# Altium project controle_motor_official.PrjPcb
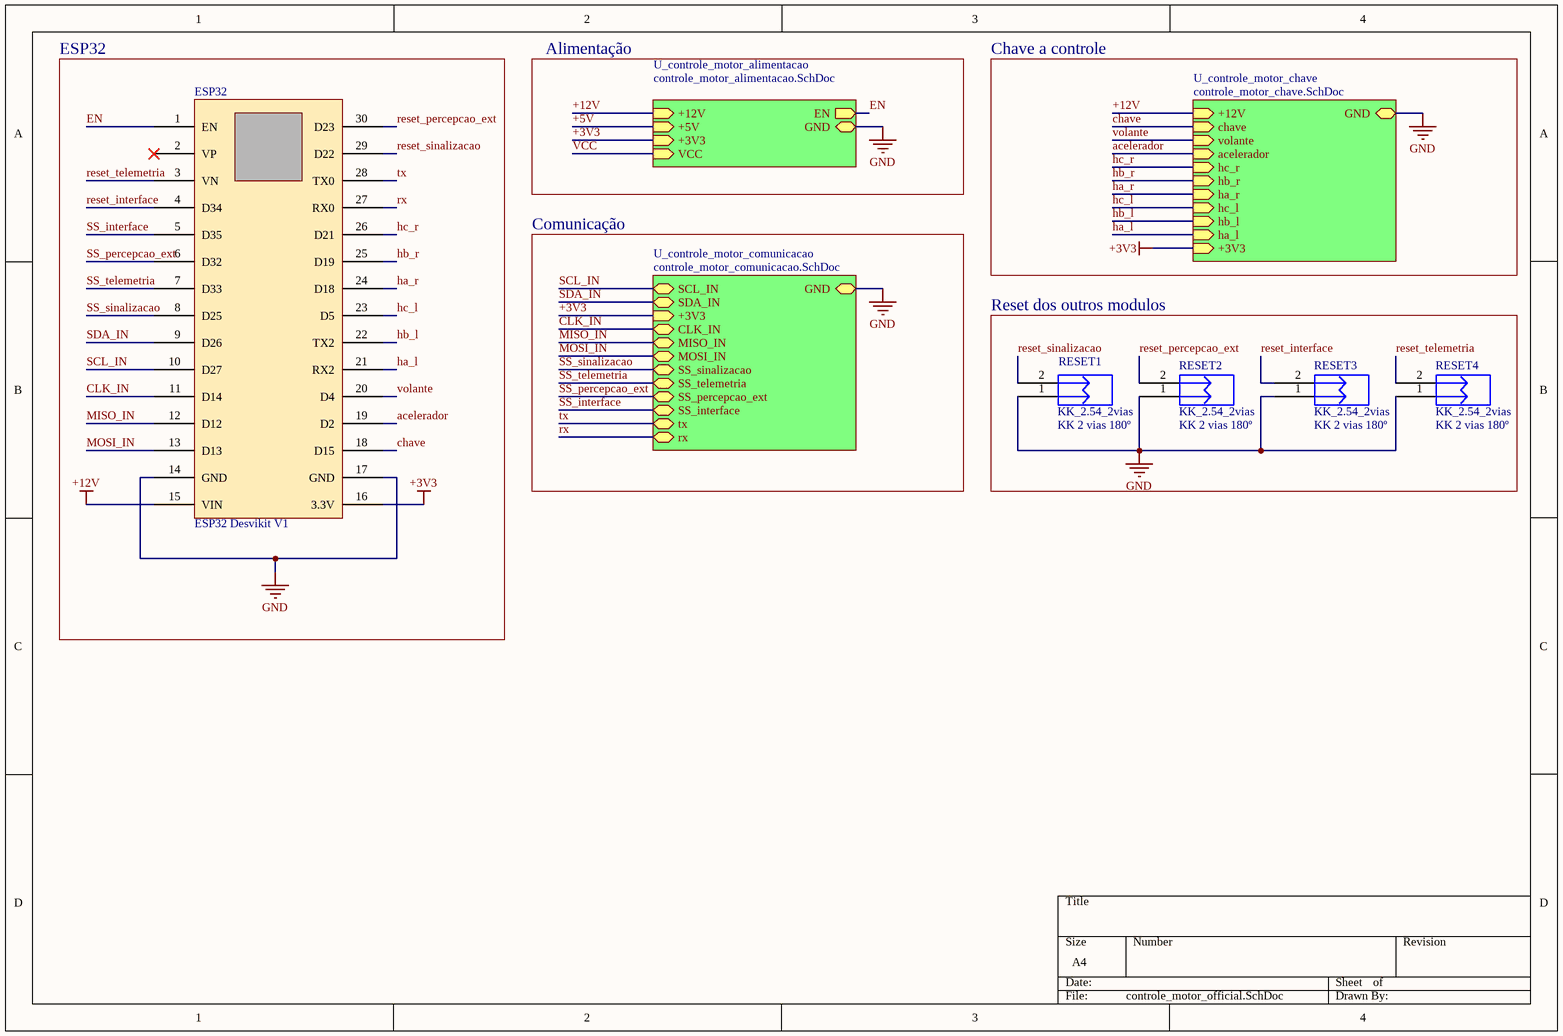
[diagram p0: controle_motor_official.SchDoc]
4 sheets, 45 parts. Net scope: hierarchical (ports join the sheet entries above them; power ports are global).
Board file: controle_motor_official.PcbDoc
Sheets:
  controle_motor_official.SchDoc
    U_controle_motor_alimentacao = controle_motor_alimentacao.SchDoc
    U_controle_motor_chave = controle_motor_chave.SchDoc
    U_controle_motor_comunicacao = controle_motor_comunicacao.SchDoc

## Sheet controle_motor_official.SchDoc
size A4; SheetNumber: 1; SheetTotal: 4

### Parts
ESP32  value ESP32 Desvikit V1  [ESP32_Desvikit_v1]  (hidden comment: microcontrolador)
RESET1  KK_2.54_2vias  Valor: KK 2 vias 180º  [KK_2VIAS_180º]
RESET2  KK_2.54_2vias  Valor: KK 2 vias 180º  [KK_2VIAS_180º]
RESET3  KK_2.54_2vias  Valor: KK 2 vias 180º  [KK_2VIAS_180º]
RESET4  KK_2.54_2vias  Valor: KK 2 vias 180º  [KK_2VIAS_180º]

### Blocks framed on the sheet
ESP32: ESP32
Reset dos outros modulos: RESET1-RESET4

### Sub-sheets
U_controle_motor_alimentacao = controle_motor_alimentacao.SchDoc: EN (out), GND (bidir), +12V (in), +5V (in), +3V3 (in), VCC (in)
U_controle_motor_chave = controle_motor_chave.SchDoc: GND (bidir), +12V (in), chave (in), volante (in), acelerador (in), hc_r (in), hb_r (in), ha_r (in), hc_l (in), hb_l (in), ha_l (in), +3V3 (in)
U_controle_motor_comunicacao = controle_motor_comunicacao.SchDoc: SCL_IN (bidir), SDA_IN (bidir), GND (bidir), +3V3 (in), CLK_IN (bidir), MISO_IN (bidir), MOSI_IN (bidir), SS_sinalizacao (bidir), SS_telemetria (bidir), SS_percepcao_ext (bidir), SS_interface (bidir), tx (bidir), rx (bidir)

### Nets
+3V3: ESP32.16(3.3V) ; sheet U_controle_motor_alimentacao/+3V3, sheet U_controle_motor_chave/+3V3, sheet U_controle_motor_comunicacao/+3V3
+12V: ESP32.15(VIN) ; sheet U_controle_motor_alimentacao/+12V, sheet U_controle_motor_chave/+12V
GND: ESP32.14(GND) ESP32.17(GND) RESET1.1 RESET2.1 RESET3.1 RESET4.1 ; sheet U_controle_motor_alimentacao/GND, sheet U_controle_motor_chave/GND, sheet U_controle_motor_comunicacao/GND
acelerador: ESP32.19(D2) ; sheet U_controle_motor_chave/acelerador
chave: ESP32.18(D15) ; sheet U_controle_motor_chave/chave
CLK_IN: ESP32.11(D14) ; sheet U_controle_motor_comunicacao/CLK_IN
EN: ESP32.1(EN) ; sheet U_controle_motor_alimentacao/EN
ha_l: ESP32.21(RX2) ; sheet U_controle_motor_chave/ha_l
ha_r: ESP32.24(D18) ; sheet U_controle_motor_chave/ha_r
hb_l: ESP32.22(TX2) ; sheet U_controle_motor_chave/hb_l
hb_r: ESP32.25(D19) ; sheet U_controle_motor_chave/hb_r
hc_l: ESP32.23(D5) ; sheet U_controle_motor_chave/hc_l
hc_r: ESP32.26(D21) ; sheet U_controle_motor_chave/hc_r
MISO_IN: ESP32.12(D12) ; sheet U_controle_motor_comunicacao/MISO_IN
MOSI_IN: ESP32.13(D13) ; sheet U_controle_motor_comunicacao/MOSI_IN
reset_interface: ESP32.4(D34) RESET3.2
reset_percepcao_ext: ESP32.30(D23) RESET2.2
reset_sinalizacao: ESP32.29(D22) RESET1.2
reset_telemetria: ESP32.3(VN) RESET4.2
rx: ESP32.27(RX0) ; sheet U_controle_motor_comunicacao/rx
SCL_IN: ESP32.10(D27) ; sheet U_controle_motor_comunicacao/SCL_IN
SDA_IN: ESP32.9(D26) ; sheet U_controle_motor_comunicacao/SDA_IN
SS_interface: ESP32.5(D35) ; sheet U_controle_motor_comunicacao/SS_interface
SS_percepcao_ext: ESP32.6(D32) ; sheet U_controle_motor_comunicacao/SS_percepcao_ext
SS_sinalizacao: ESP32.8(D25) ; sheet U_controle_motor_comunicacao/SS_sinalizacao
SS_telemetria: ESP32.7(D33) ; sheet U_controle_motor_comunicacao/SS_telemetria
tx: ESP32.28(TX0) ; sheet U_controle_motor_comunicacao/tx
VCC: sheet U_controle_motor_alimentacao/VCC
volante: ESP32.20(D4) ; sheet U_controle_motor_chave/volante

Not connected (* = marked no-connect by the designer): ESP32 2(VP)*

### Notes on the sheet
- Alimentação
- Chave a controle
- Comunicação

### Library data of the parts
ESP32 = ESP32 Desvikit v1: microcontrolador com moculo bluethoth e wifi
RESET1-RESET4 = KK_2.54_2vias: Conector KK 2.54mm 2 vias; Descrição: Conector KK 3 vias com passo 2.54mm; Encapsulamento: PTH - 180º; Modelo: 2 vias - 180º; Marca: *; Observação: *

## Sheet controle_motor_alimentacao.SchDoc
size A4; SheetNumber: 3; SheetTotal: 4
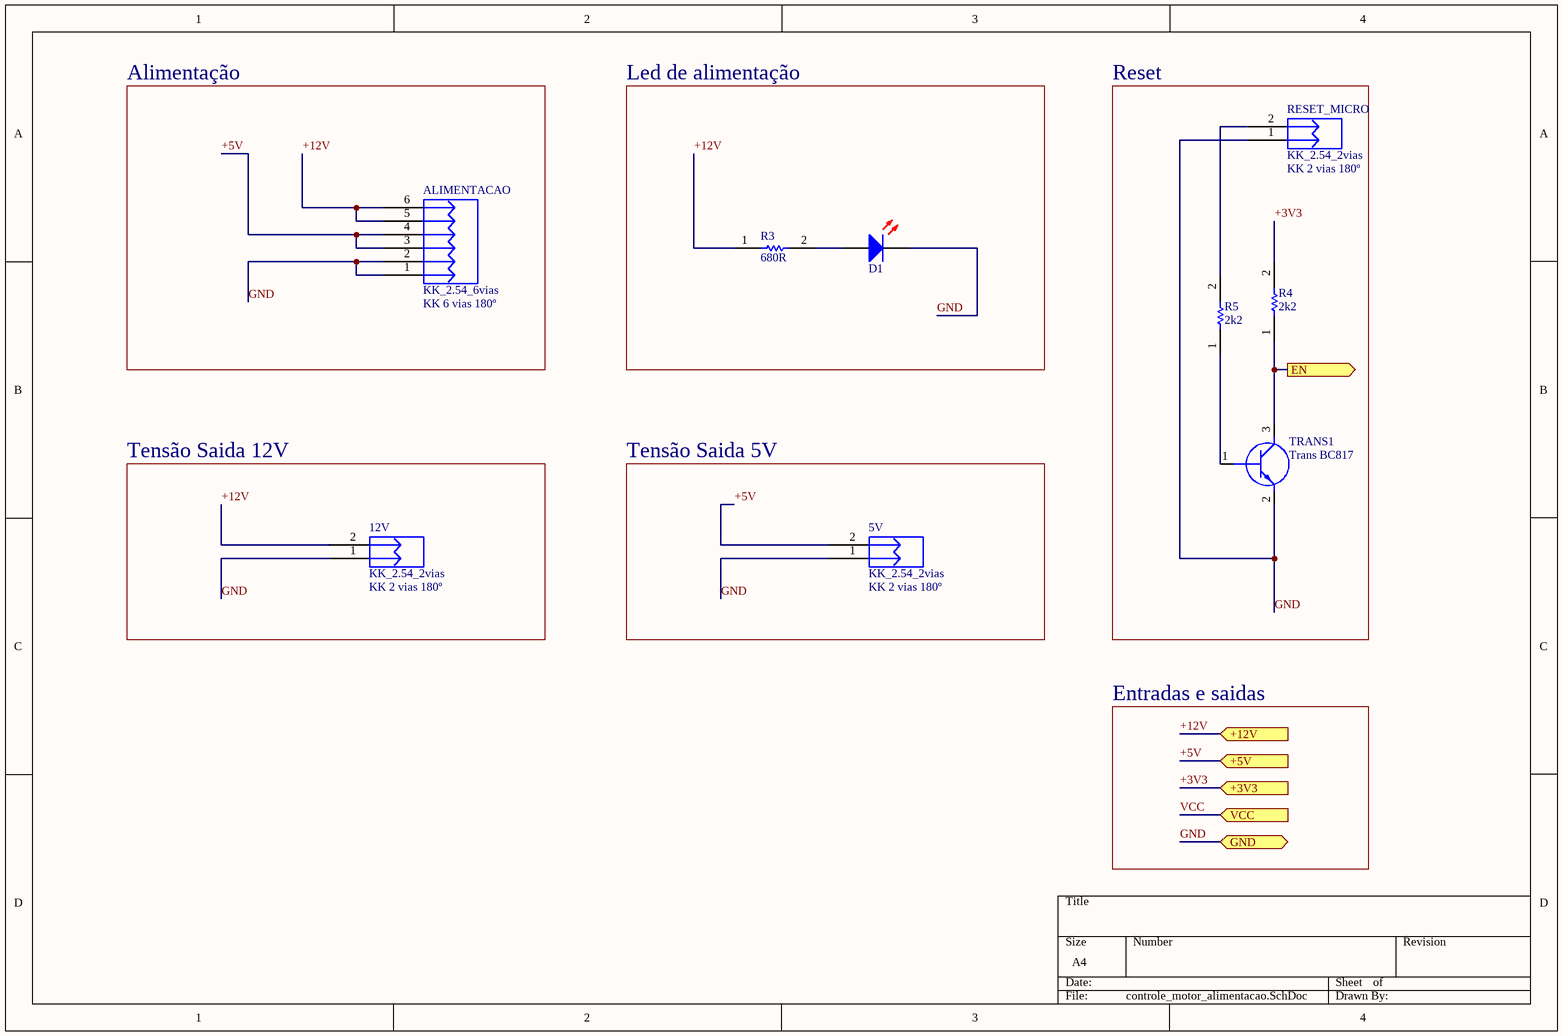
[diagram p1: controle_motor_alimentacao.SchDoc]

### Parts
5V  KK_2.54_2vias  Valor: KK 2 vias 180º  [KK_2VIAS_180º]
12V  KK_2.54_2vias  Valor: KK 2 vias 180º  [KK_2VIAS_180º]
ALIMENTACAO  KK_2.54_6vias  Valor: KK 6 vias 180º  [KK_6vias_180°]
D1  LED 3MM RED  [LED RED]  (value not drawn)
R3  680R  [RESC3216X60N]
R4  2k2  [RESC3216X60N]
R5  2k2  [RESC3216X60N]
RESET_MICRO  KK_2.54_2vias  Valor: KK 2 vias 180º  [KK_2VIAS_180º]
TRANS1  Trans BC817  [SOT96P240X110-3N]

### Blocks framed on the sheet
Alimentação: ALIMENTACAO
Led de alimentação: D1 R3
Reset: R4 R5 RESET_MICRO TRANS1
Tensão Saida 12V: 12V
Tensão Saida 5V: 5V

### Ports
+3V3 (in), +5V (in), +12V (in), EN (out), GND (bidir), VCC (in)

### Nets
+3V3: R4.2 ; port +3V3
+12V: 12V.2 ALIMENTACAO.5 ALIMENTACAO.6 R3.1 ; port +12V
GND: 5V.1 12V.1 ALIMENTACAO.1 ALIMENTACAO.2 D1.2(K) RESET_MICRO.1 TRANS1.2(E) ; port GND
+5V: 5V.2 ALIMENTACAO.3 ALIMENTACAO.4 ; port +5V
EN: R4.1 TRANS1.3(C) ; port EN
VCC: port VCC
NetD1_1: D1.1(A) R3.2
NetR5_1: R5.1 TRANS1.1(B)
NetR5_2: R5.2 RESET_MICRO.2

### Notes on the sheet
- Entradas e saidas

### Library data of the parts
5V 12V RESET_MICRO = KK_2.54_2vias: as RESET1 on sheet controle_motor_official; Marca: *; Observação: *
ALIMENTACAO = KK_2.54_6vias: Conector KK 2.54mm 6 vias; Descrição: Conector KK 3 vias com passo 2.54mm; Encapsulamento: PTH - 180º; Modelo: 3 vias - 180º; Marca: *; Observação: *
D1 = LED 3MM RED: Manufacturer: Paralight; Manufacturer Part Number: IMP585; Wavelength Typ: 625; Forward Voltage: 2; Forward Current If: 20; Luminous Intensity: 3; LED Mounting: Through Hole; Lens Shape: Round; Viewing Angle: 60°; SVHC: No SVHC (15-Jun-2015); External Diameter: 2.9; External Length / Height: 4.6; Forward Voltage VF Max: 2.5; LED / Lamp Size: 3mm / T-1; LED Type: Standard; Lead Cross-section Depth: 0.5; Luminous Intensity @ If Min: 0.7; PIV Max: 5; Peak Forward Current: 7; Voltage Vf Typ: 2.2V<!--FANDB--><div class="features-and-benefits-container"><div class="features-and-benefits-description"><span class="features-benefits-value">The L-934LID from Kingbright is a through hole round shape high efficiency red colour LED. The device is made of gallium arsenide phosphide on gallium phosphide orange light emitting diode. This LED is widely used because of low power consumption, long life and solid state reliability.</span></div><div class="features-and-benefits-list"><ul class="features-and-benefits-list-list"><li class="features-and-benefits-list-item">Standard bulb size of T-1 (3mm)</li><li class="features-and-benefits-list-item">Reliable and rugged</li><li class="features-and-benefits-list-item">Viewing angle is 60°</li><li class="features-and-benefits-list-item">Luminous intensity of 3mcd at 2mA</li><li class="features-and-benefits-list-item">Forward voltage is 2.0V</li><li class="features-and-benefits-list-item">Forward current (If) is 20mA</li><li class="features-and-benefits-list-item">Dominant wavelength is 625nm at IF=20mA</li><li class="features-and-benefits-list-item">Peak wavelength is 627nm at IF=20; Supplier 1: Mult Comercial; RoHS: YES; Stock 1: 35260; Pricing 1: 1=0.15 (BRL); LED Colour: Red; Bulb Size: 3mm; Packaging: Each; MSL: -; Current If Luminous Intensity: 2; Dominant Wavelength: 625; Forward Current If Max: 20; Lead Cross-section Width: 0.5; Lead Spacing: 2.54; Luminous Intensity Typ: 3; Mounting Type: PCB Through Hole; No. of Pins: 2; Operating Temperature Max: 85; Operating Temperature Min: -40; Operating Temperature Range: -40°C to +85; Peak Wavelength: 625; ComponentLink1URL: http://loja.multcomercial.com.br/led-3mm-vermelho-difuso-l-314hd-paralight.html; ComponentLink1Description: http://loja.multcomercial.com.br/led-3mm-vermelho-difuso-l-314hd-paralight.html; Supplier Part Number 1: Led 3mm Vermelho Difuso L-314HD - Paralight
R3-R5 = Resistor 1206: Resistor; Manufacturer_Name: Vishay; Manufacturer_Part_Number: CRCW12064K70FKEA; Datasheet Link: http://docs-emea.rs-online.com/webdocs/13ec/0900766b813ecc08.pdf; Height: 0.6mm; Mouser Part Number: 71-CRCW1206-4.7K-E3; Mouser Price/Stock: https://www.mouser.co.uk/ProductDetail/Vishay-Dale/CRCW12064K70FKEA?qs=1vm4qhDHCvlKJmatsKzyFQ%3D%3D; Arrow Part Number: CRCW12064K70FKEA; Arrow Price/Stock: https://www.arrow.com/en/products/crcw12064k70fkea/vishay
TRANS1 = Trans BC817: Transistor BJT NPN BC817-25-7-F; Manufacturer_Name: Diodes Inc.; Datasheet Link: https://www.diodes.com/assets/Datasheets/ds11107.pdf; Height: 1.1mm; Manufacturer_Part_Number: BC817-25-7-F; Mouser Part Number: 621-BC817-25-7-F; Mouser Price/Stock: https://www.mouser.co.uk/ProductDetail/Diodes-Incorporated/BC817-25-7-F?qs=rGAXPo9uwV0jK0EyLZnqOw%3D%3D; Arrow Part Number: BC817-25-7-F; Arrow Price/Stock: https://www.arrow.com/en/products/bc817-25-7-f/diodes-incorporated

## Sheet controle_motor_chave.SchDoc
size A4; SheetNumber: 4; SheetTotal: 4
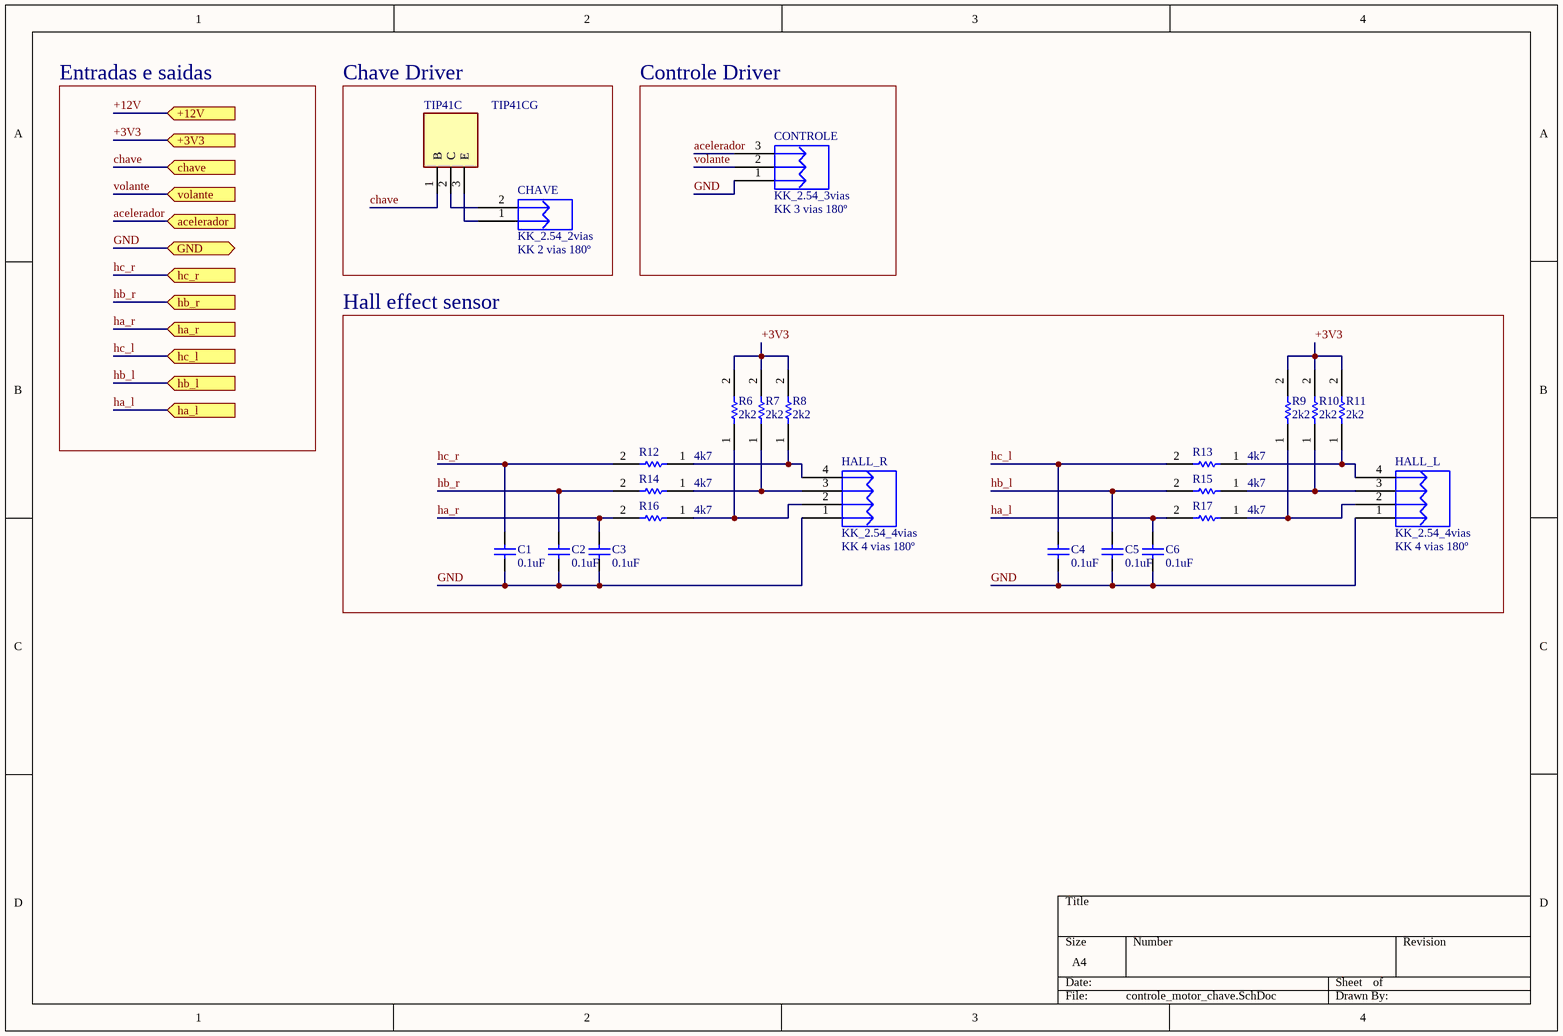
[diagram p2: controle_motor_chave.SchDoc]

### Parts
C1  0.1uF  [CAP CER DISK 0.1uF]
C2  0.1uF  [CAP CER DISK 0.1uF]
C3  0.1uF  [CAP CER DISK 0.1uF]
C4  0.1uF  [CAP CER DISK 0.1uF]
C5  0.1uF  [CAP CER DISK 0.1uF]
C6  0.1uF  [CAP CER DISK 0.1uF]
CHAVE  KK_2.54_2vias  Valor: KK 2 vias 180º  [KK_2VIAS_180º]
CONTROLE  KK_2.54_3vias  Valor: KK 3 vias 180º  [KK_3vias_180º]
HALL_L  KK_2.54_4vias  Valor: KK 4 vias 180º  [KK_4vias_180°]
HALL_R  KK_2.54_4vias  Valor: KK 4 vias 180º  [KK_4vias_180°]
R6  2k2  [RESC3216X60N]
R7  2k2  [RESC3216X60N]
R8  2k2  [RESC3216X60N]
R9  2k2  [RESC3216X60N]
R10  2k2  [RESC3216X60N]
R11  2k2  [RESC3216X60N]
R12  4k7  [RESC3216X60N]
R13  4k7  [RESC3216X60N]
R14  4k7  [RESC3216X60N]
R15  4k7  [RESC3216X60N]
R16  4k7  [RESC3216X60N]
R17  4k7  [RESC3216X60N]
TIP41C  TIP41CG  [TO254P483X1010X2035-3P]

### Blocks framed on the sheet
Chave Driver: CHAVE TIP41C
Controle Driver: CONTROLE
Hall effect sensor: C1-C6 HALL_L HALL_R R6-R17

### Ports
+3V3 (in), +12V (in), acelerador (in), chave (in), GND (bidir), ha_l (in), ha_r (in), hb_l (in), hb_r (in), hc_l (in), hc_r (in), volante (in)

### Nets
+3V3: R6.2 R7.2 R8.2 R9.2 R10.2 R11.2 ; port +3V3
GND: C1.1 C2.1 C3.1 C4.1 C5.1 C6.1 CONTROLE.1 HALL_L.1 HALL_R.1 ; port GND
acelerador: CONTROLE.3 ; port acelerador
chave: TIP41C.1(B) ; port chave
ha_l: C6.2 R17.2 ; port ha_l
ha_r: C3.2 R16.2 ; port ha_r
hb_l: C5.2 R15.2 ; port hb_l
hb_r: C2.2 R14.2 ; port hb_r
hc_l: C4.2 R13.2 ; port hc_l
hc_r: C1.2 R12.2 ; port hc_r
volante: CONTROLE.2 ; port volante
NetCHAVE_1: CHAVE.1 TIP41C.3(E)
NetCHAVE_2: CHAVE.2 TIP41C.2(C)
NetHALL_L_2: HALL_L.2 R9.1 R17.1
NetHALL_L_3: HALL_L.3 R10.1 R15.1
NetHALL_L_4: HALL_L.4 R11.1 R13.1
NetHALL_R_2: HALL_R.2 R6.1 R16.1
NetHALL_R_3: HALL_R.3 R7.1 R14.1
NetHALL_R_4: HALL_R.4 R8.1 R12.1

### Notes on the sheet
- Entradas e saidas

### Library data of the parts
C1-C6 = CAP CER DISK 0.1uF: Manufacturer Part Number: IMP14925; Product Range: MCFY Series; Capacitance Tolerance: +80%, -20%; Dielectric Characteristic: Y5; Voltage Rating: 50; Capacitor Terminals: Radial Leaded; SVHC: No SVHC (15-Jun-2015); Supplier 1: Mult Comercial; Manufacturer: -; RoHS: YES; Stock 1: 115809; Pricing 1: 1=0.10 (BRL); Capacitance: 0.1uF; Packaging: Each; Lead Spacing: 5; Operating Temperature Min: -25; Operating Temperature Max: 85; Capacitance Tolerance ±: +80%, -20%; Operating Temperature Range: -25°C to +85°C<!--FANDB--><div class="features-and-benefits-container"><div class="features-and-benefits-description"><span class="features-benefits-value">The MCFY series from Multicomp are radial leaded ceramic disc capacitors. The capacitance values ranges from 6800pF to 0.22?F.</span></div><div class="features-and-benefits-list"><ul class="features-and-benefits-list-list"><li class="features-and-benefits-list-item">Large capacitance in small size</li><li class="features-and-benefits-list-item">Rated voltage of 50V</li><li class="features-and-benefits-list-item">80%/-20% tolerance</li><li class="features-and-benefits-list-item">Operating temperature range -25°C to +85; ComponentLink1URL: http://loja.multcomercial.com.br/capacitor-ceramico-disco-100kpf-50v-104-100k-100nf-0-1uf-cod-1351.html; ComponentLink1Description: http://loja.multcomercial.com.br/capacitor-ceramico-disco-100kpf-50v-104-100k-100nf-0-1uf-cod-1351.html; Supplier Part Number 1: Capacitor Cerâmico Disco 100Kpf/50V (104/100K/100nF/0.1uF) cód. 1351
CHAVE = KK_2.54_2vias: as RESET1 on sheet controle_motor_official; Marca: *; Observação: *
CONTROLE = KK_2.54_3vias: Conector KK 2.54mm 3 vias; Descrição: Conector KK 3 vias com passo 2.54mm; Encapsulamento: PTH - 180º; Modelo: 3 vias - 180º; Marca: *; Observação: *
HALL_L HALL_R = KK_2.54_4vias: Conector KK 2.54mm 4 vias; Descrição: Conector KK 3 vias com passo 2.54mm; Encapsulamento: PTH - 180º; Modelo: 3 vias - 180º; Marca: *; Observação: *
R6-R11 = Resistor 1206: as R3 on sheet controle_motor_alimentacao; Datasheet Link: http://docs-emea.rs-online.com/webdocs/13ec/0900766b813ecc08.pdf; Height: 0.6mm; Mouser Part Number: 71-CRCW1206-4.7K-E3; Mouser Price/Stock: https://www.mouser.co.uk/ProductDetail/Vishay-Dale/CRCW12064K70FKEA?qs=1vm4qhDHCvlKJmatsKzyFQ%3D%3D; Arrow Part Number: CRCW12064K70FKEA; Arrow Price/Stock: https://www.arrow.com/en/products/crcw12064k70fkea/vishay
R12-R17 = RES 1206: RES 1206 5%; Manufacturer_Name: Vishay; Manufacturer_Part_Number: CRCW12064K70FKEA; Datasheet Link: http://docs-emea.rs-online.com/webdocs/13ec/0900766b813ecc08.pdf; Height: 0.6mm; Mouser Part Number: 71-CRCW1206-4.7K-E3; Mouser Price/Stock: https://www.mouser.co.uk/ProductDetail/Vishay-Dale/CRCW12064K70FKEA?qs=1vm4qhDHCvlKJmatsKzyFQ%3D%3D; Arrow Part Number: CRCW12064K70FKEA; Arrow Price/Stock: https://www.arrow.com/en/products/crcw12064k70fkea/vishay
TIP41C = TIP41CG: Transistor; Manufacturer_Name: ON Semiconductor; Datasheet Link: http://www.onsemi.com/pub/Collateral/TIP41A-D.PDF; Height: 4.83mm; Manufacturer_Part_Number: TIP41CG; Mouser Part Number: 863-TIP41CG; Mouser Price/Stock: https://www.mouser.co.uk/ProductDetail/onsemi/TIP41CG?qs=xZq1yRCsb1dnnb4X32QAFQ%3D%3D; Arrow Part Number: TIP41CG; Arrow Price/Stock: https://www.arrow.com/en/products/tip41cg/on-semiconductor

## Sheet controle_motor_comunicacao.SchDoc
size A4; SheetNumber: 2; SheetTotal: 4
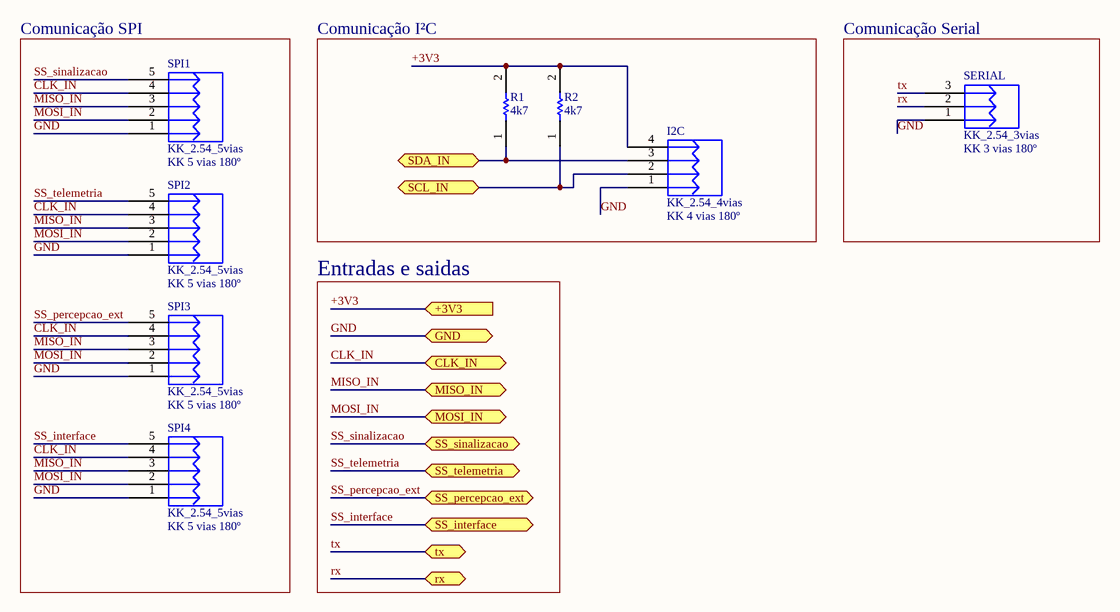
[diagram p3: controle_motor_comunicacao.SchDoc]

### Parts
I2C  KK_2.54_4vias  Valor: KK 4 vias 180º  [KK_4vias_180°]
R1  4k7  [RESC3216X60N]
R2  4k7  [RESC3216X60N]
SERIAL  KK_2.54_3vias  Valor: KK 3 vias 180º  [KK_3vias_180º]
SPI1  KK_2.54_5vias  Valor: KK 5 vias 180º  [KK_5vias_180°]
SPI2  KK_2.54_5vias  Valor: KK 5 vias 180º  [KK_5vias_180°]
SPI3  KK_2.54_5vias  Valor: KK 5 vias 180º  [KK_5vias_180°]
SPI4  KK_2.54_5vias  Valor: KK 5 vias 180º  [KK_5vias_180°]

### Blocks framed on the sheet
Comunicação SPI: SPI1-SPI4
Comunicação I²C: I2C R1 R2
Comunicação Serial: SERIAL

### Ports
+3V3 (in), CLK_IN (bidir), GND (bidir), MISO_IN (bidir), MOSI_IN (bidir), rx (bidir), SCL_IN (bidir), SDA_IN (bidir), SS_interface (bidir), SS_percepcao_ext (bidir), SS_sinalizacao (bidir), SS_telemetria (bidir), tx (bidir)

### Nets
+3V3: I2C.4 R1.2 R2.2 ; port +3V3
GND: I2C.1 SERIAL.1 SPI1.1 SPI2.1 SPI3.1 SPI4.1 ; port GND
CLK_IN: SPI1.4 SPI2.4 SPI3.4 SPI4.4 ; port CLK_IN
MISO_IN: SPI1.3 SPI2.3 SPI3.3 SPI4.3 ; port MISO_IN
MOSI_IN: SPI1.2 SPI2.2 SPI3.2 SPI4.2 ; port MOSI_IN
rx: SERIAL.2 ; port rx
SCL_IN: I2C.2 R2.1 ; port SCL_IN
SDA_IN: I2C.3 R1.1 ; port SDA_IN
SS_interface: SPI4.5 ; port SS_interface
SS_percepcao_ext: SPI3.5 ; port SS_percepcao_ext
SS_sinalizacao: SPI1.5 ; port SS_sinalizacao
SS_telemetria: SPI2.5 ; port SS_telemetria
tx: SERIAL.3 ; port tx

### Notes on the sheet
- Entradas e saidas

### Library data of the parts
I2C = KK_2.54_4vias: as HALL_L on sheet controle_motor_chave; Marca: *; Observação: *
R1 R2 = RES 1206: as R12 on sheet controle_motor_chave; Datasheet Link: http://docs-emea.rs-online.com/webdocs/13ec/0900766b813ecc08.pdf; Height: 0.6mm; Mouser Part Number: 71-CRCW1206-4.7K-E3; Mouser Price/Stock: https://www.mouser.co.uk/ProductDetail/Vishay-Dale/CRCW12064K70FKEA?qs=1vm4qhDHCvlKJmatsKzyFQ%3D%3D; Arrow Part Number: CRCW12064K70FKEA; Arrow Price/Stock: https://www.arrow.com/en/products/crcw12064k70fkea/vishay
SERIAL = KK_2.54_3vias: as CONTROLE on sheet controle_motor_chave; Marca: *; Observação: *
SPI1-SPI4 = KK_2.54_5vias: Conector KK 2.54mm 5 vias; Descrição: Conector KK 3 vias com passo 2.54mm; Encapsulamento: PTH - 180º; Modelo: 3 vias - 180º; Marca: *; Observação: *

## Nets that join several sheets
+3V3: controle_motor_official (ESP32.16), controle_motor_alimentacao (R4.2), controle_motor_chave (6 pins), controle_motor_comunicacao (I2C.4 R1.2 R2.2)
+12V: controle_motor_official (ESP32.15), controle_motor_alimentacao (12V.2 ALIMENTACAO.5 ALIMENTACAO.6 R3.1)
GND: controle_motor_official (6 pins), controle_motor_alimentacao (7 pins), controle_motor_chave (9 pins), controle_motor_comunicacao (6 pins)
acelerador: controle_motor_official (ESP32.19), controle_motor_chave (CONTROLE.3)
chave: controle_motor_official (ESP32.18), controle_motor_chave (TIP41C.1)
CLK_IN: controle_motor_official (ESP32.11), controle_motor_comunicacao (SPI1.4 SPI2.4 SPI3.4 SPI4.4)
EN: controle_motor_official (ESP32.1), controle_motor_alimentacao (R4.1 TRANS1.3)
ha_l: controle_motor_official (ESP32.21), controle_motor_chave (C6.2 R17.2)
ha_r: controle_motor_official (ESP32.24), controle_motor_chave (C3.2 R16.2)
hb_l: controle_motor_official (ESP32.22), controle_motor_chave (C5.2 R15.2)
hb_r: controle_motor_official (ESP32.25), controle_motor_chave (C2.2 R14.2)
hc_l: controle_motor_official (ESP32.23), controle_motor_chave (C4.2 R13.2)
hc_r: controle_motor_official (ESP32.26), controle_motor_chave (C1.2 R12.2)
MISO_IN: controle_motor_official (ESP32.12), controle_motor_comunicacao (SPI1.3 SPI2.3 SPI3.3 SPI4.3)
MOSI_IN: controle_motor_official (ESP32.13), controle_motor_comunicacao (SPI1.2 SPI2.2 SPI3.2 SPI4.2)
rx: controle_motor_official (ESP32.27), controle_motor_comunicacao (SERIAL.2)
SCL_IN: controle_motor_official (ESP32.10), controle_motor_comunicacao (I2C.2 R2.1)
SDA_IN: controle_motor_official (ESP32.9), controle_motor_comunicacao (I2C.3 R1.1)
SS_interface: controle_motor_official (ESP32.5), controle_motor_comunicacao (SPI4.5)
SS_percepcao_ext: controle_motor_official (ESP32.6), controle_motor_comunicacao (SPI3.5)
SS_sinalizacao: controle_motor_official (ESP32.8), controle_motor_comunicacao (SPI1.5)
SS_telemetria: controle_motor_official (ESP32.7), controle_motor_comunicacao (SPI2.5)
tx: controle_motor_official (ESP32.28), controle_motor_comunicacao (SERIAL.3)
volante: controle_motor_official (ESP32.20), controle_motor_chave (CONTROLE.2)